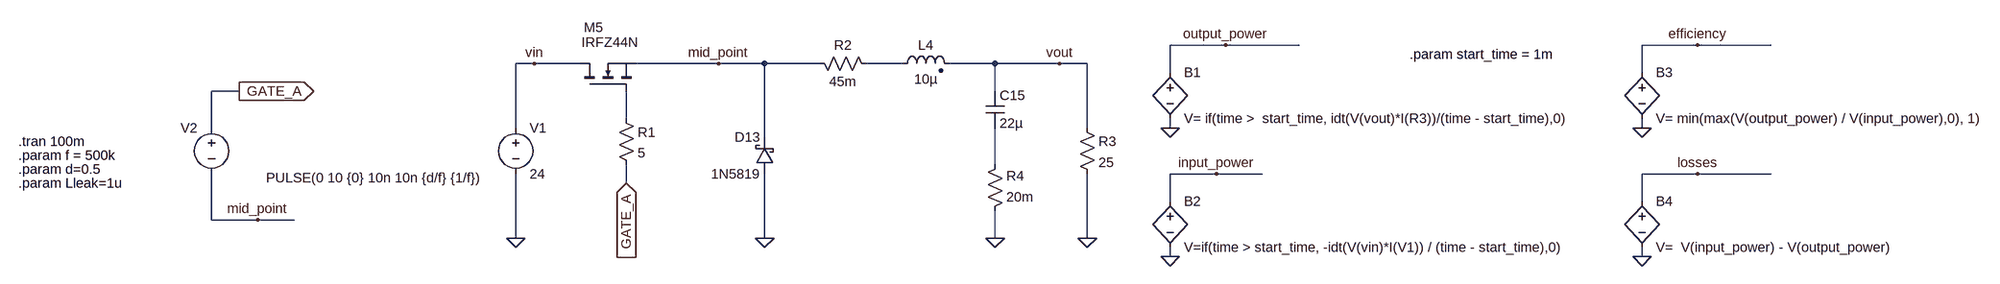
[diagram p0: schematic buck_converter.asc]
buck_converter.asc, the LTspice schematic file:
Version 4
SHEET 1 5024 2180
WIRE 128 -704 32 -704
WIRE 256 -704 128 -704
WIRE 1072 -704 976 -704
WIRE 1200 -704 1072 -704
WIRE -1072 -672 -1104 -672
WIRE -992 -672 -1072 -672
WIRE -752 -672 -896 -672
WIRE -672 -672 -752 -672
WIRE -576 -672 -672 -672
WIRE -432 -672 -496 -672
WIRE -272 -672 -352 -672
WIRE -160 -672 -272 -672
WIRE -112 -672 -160 -672
WIRE 32 -656 32 -704
WIRE 976 -656 976 -704
WIRE -1584 -624 -1632 -624
WIRE -272 -624 -272 -672
WIRE -912 -576 -912 -624
WIRE -1632 -560 -1632 -624
WIRE -1104 -560 -1104 -672
WIRE -112 -560 -112 -672
WIRE 32 -560 32 -576
WIRE 976 -560 976 -576
WIRE -672 -544 -672 -672
WIRE -272 -496 -272 -560
WIRE 112 -480 32 -480
WIRE 192 -480 112 -480
WIRE 1072 -480 976 -480
WIRE 1200 -480 1072 -480
WIRE -912 -464 -912 -496
WIRE 32 -432 32 -480
WIRE 976 -432 976 -480
WIRE -1632 -400 -1632 -480
WIRE -1552 -400 -1632 -400
WIRE -1488 -400 -1552 -400
WIRE -1104 -368 -1104 -480
WIRE -672 -368 -672 -480
WIRE -272 -368 -272 -416
WIRE -112 -368 -112 -480
WIRE 32 -336 32 -352
WIRE 976 -336 976 -352
FLAG -1584 -624 GATE_A
IOPIN -1584 -624 Out
FLAG -272 -368 0
FLAG -1104 -368 0
FLAG -912 -464 GATE_A
IOPIN -912 -464 In
FLAG -672 -368 0
FLAG -112 -368 0
FLAG 32 -560 0
FLAG 32 -336 0
FLAG 128 -704 output_power
FLAG 112 -480 input_power
FLAG 976 -560 0
FLAG 1072 -704 efficiency
FLAG 976 -336 0
FLAG 1072 -480 losses
FLAG -1072 -672 vin
FLAG -160 -672 vout
FLAG -752 -672 mid_point
FLAG -1552 -400 mid_point
SYMBOL voltage -1632 -576 M0
WINDOW 123 0 0 Left 0
WINDOW 39 0 0 Left 0
WINDOW 3 -468 103 Left 2
SYMATTR Value PULSE(0 10 {0} 10n 10n {d/f} {1/f})
SYMATTR InstName V2
SYMBOL cap -288 -624 R0
SYMATTR InstName C15
SYMATTR Value 22µ
SYMBOL res -480 -656 M270
WINDOW 0 32 56 VTop 2
WINDOW 3 0 56 VBottom 2
SYMATTR InstName R2
SYMATTR Value 45m
SYMBOL res -288 -400 M180
WINDOW 0 36 76 Left 2
WINDOW 3 36 40 Left 2
SYMATTR InstName R4
SYMATTR Value 20m
SYMBOL voltage -1104 -576 R0
WINDOW 123 0 0 Left 0
WINDOW 39 0 0 Left 0
SYMATTR InstName V1
SYMATTR Value 24
SYMBOL res -928 -592 R0
SYMATTR InstName R1
SYMATTR Value 5
SYMBOL nmos -992 -624 R270
WINDOW 0 111 6 VRight 2
WINDOW 3 85 2 VRight 2
SYMATTR InstName M5
SYMATTR Value IRFZ44N
SYMBOL schottky -656 -480 R180
WINDOW 0 24 64 Left 2
WINDOW 3 24 0 Left 2
SYMATTR InstName D13
SYMATTR Value 1N5819
SYMATTR Description Diode
SYMATTR Type diode
SYMBOL res -128 -576 R0
SYMATTR InstName R3
SYMATTR Value 25
SYMBOL ind2 -448 -656 R270
WINDOW 0 32 56 VTop 2
WINDOW 3 4 56 VBottom 2
SYMATTR InstName L4
SYMATTR Value 10µ
SYMATTR Type ind
SYMATTR SpiceLine Rser=0.2
SYMBOL bv 32 -672 R0
SYMATTR InstName B1
SYMATTR Value V= if(time >  start_time, idt(V(vout)*I(R3))/(time - start_time),0)
SYMBOL bv 32 -448 R0
SYMATTR InstName B2
SYMATTR Value V=if(time > start_time, -idt(V(vin)*I(V1)) / (time - start_time),0)
SYMBOL bv 976 -672 R0
SYMATTR InstName B3
SYMATTR Value V= min(max(V(output_power) / V(input_power),0), 1)
SYMBOL bv 976 -448 R0
SYMATTR InstName B4
SYMATTR Value V=  V(input_power) - V(output_power)
TEXT -2064 -536 Left 2 !.tran 100m
TEXT -2064 -512 Left 2 !.param f = 500k
TEXT -2064 -464 Left 2 !.param Lleak=1u
TEXT -2064 -488 Left 2 !.param d=0.5
TEXT 448 -688 Left 2 !.param start_time = 1m

The netlist it stands for:
* buck_converter.asc
V2 GATE_A mid_point PULSE(0 10 {0} 10n 10n {d/f} {1/f})
C15 vout N003 22µ
R2 N001 mid_point 45m
R4 0 N003 20m
V1 vin 0 24
R1 N002 GATE_A 5
M5 vin N002 mid_point mid_point IRFZ44N
D13 0 mid_point 1N5819
R3 vout 0 25
L4 N001 vout 10µ Rser=0.2
B1 output_power 0 V= if(time >  start_time, idt(V(vout)*I(R3))/(time - start_time),0)
B2 input_power 0 V=if(time > start_time, -idt(V(vin)*I(V1)) / (time - start_time),0)
B3 efficiency 0 V= min(max(V(output_power) / V(input_power),0), 1)
B4 losses 0 V=  V(input_power) - V(output_power)
.model D D
.lib standard.dio
.model NMOS NMOS
.model PMOS PMOS
.lib standard.mos
.tran 100m
.param f = 500k
.param Lleak=1u
.param d=0.5
.param start_time = 1m
.backanno
.end